# Altium schematic sheet Sheet_2_2021-06-03.schdoc
size 308 x 177 mm
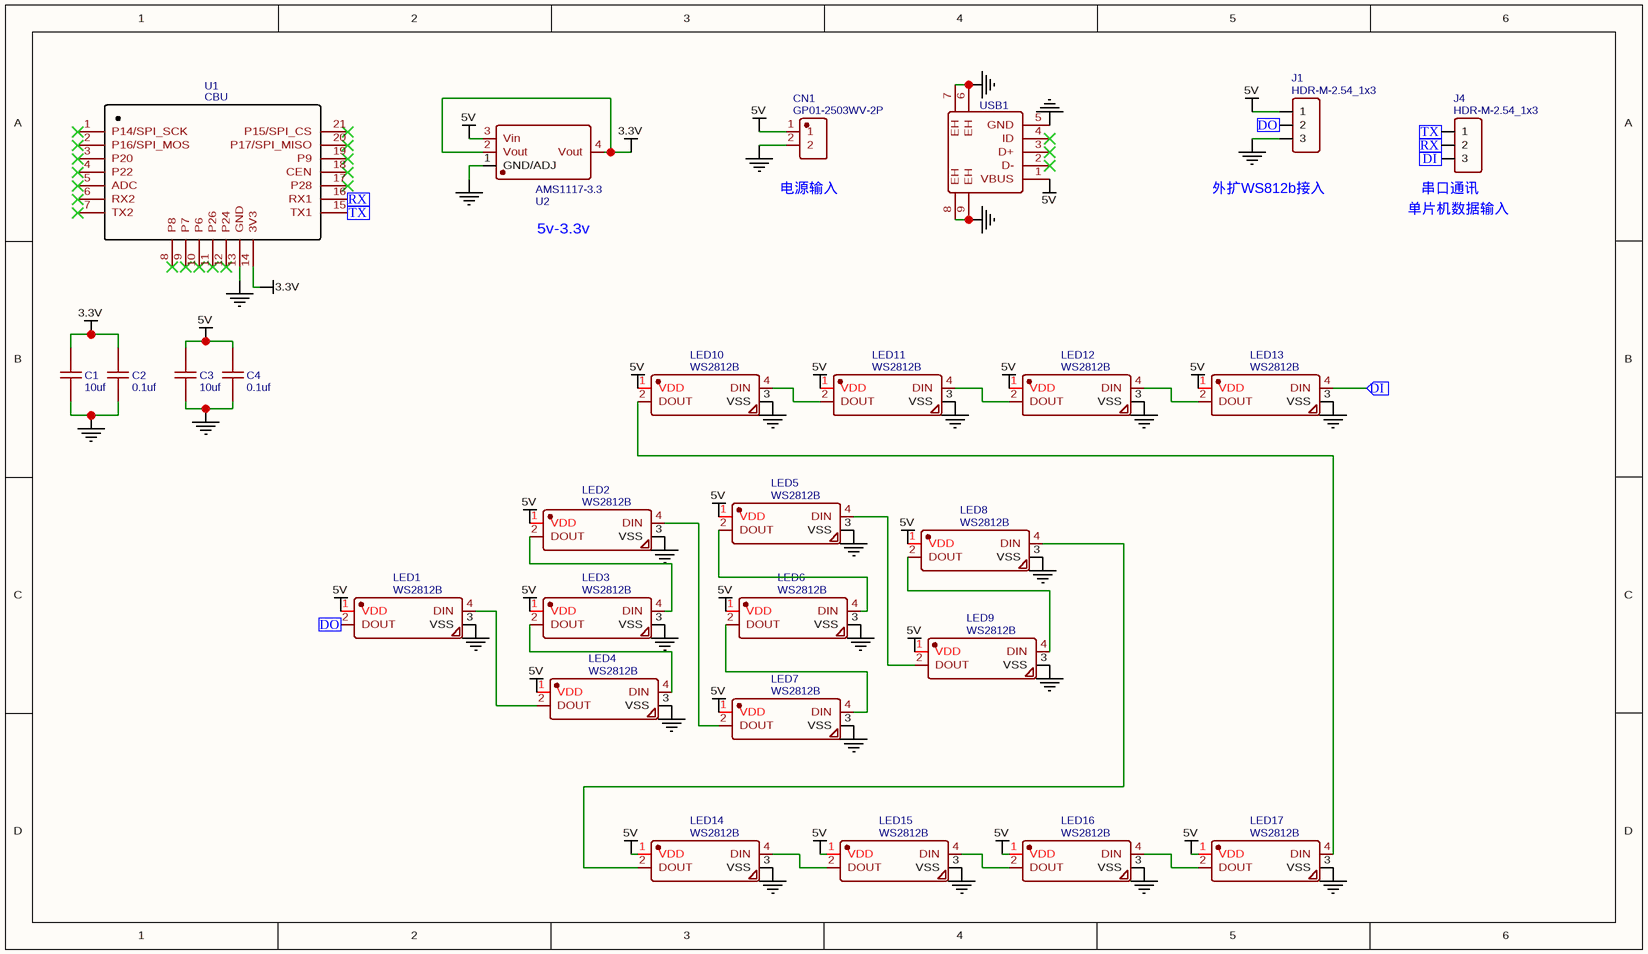
[diagram p0: Sheet_2_2021-06-03.schdoc]

## Parts
C1  10uf  [C0805]
C2  0.1uf  [C0805]
C3  10uf  [C0805]
C4  0.1uf  [C0805]
CN1  GP01-2503WV-2P  [CONN-TH_2P-P2.50_HX25003-2A]
J1  HDR-M-2.54_1x3  [HDR-M-2.54_1X3]
J4  HDR-M-2.54_1x3  [HDR-M-2.54_1X3]
LED1  WS2812B  [LED-SMD_4P-L5.0-W5.0-TL]
LED2  WS2812B  [LED-SMD_4P-L5.0-W5.0-TL]
LED3  WS2812B  [LED-SMD_4P-L5.0-W5.0-TL]
LED4  WS2812B  [LED-SMD_4P-L5.0-W5.0-TL]
LED5  WS2812B  [LED-SMD_4P-L5.0-W5.0-TL]
LED6  WS2812B  [LED-SMD_4P-L5.0-W5.0-TL]
LED7  WS2812B  [LED-SMD_4P-L5.0-W5.0-TL]
LED8  WS2812B  [LED-SMD_4P-L5.0-W5.0-TL]
LED9  WS2812B  [LED-SMD_4P-L5.0-W5.0-TL]
LED10  WS2812B  [LED-SMD_4P-L5.0-W5.0-TL]
LED11  WS2812B  [LED-SMD_4P-L5.0-W5.0-TL]
LED12  WS2812B  [LED-SMD_4P-L5.0-W5.0-TL]
LED13  WS2812B  [LED-SMD_4P-L5.0-W5.0-TL]
LED14  WS2812B  [LED-SMD_4P-L5.0-W5.0-TL]
LED15  WS2812B  [LED-SMD_4P-L5.0-W5.0-TL]
LED16  WS2812B  [LED-SMD_4P-L5.0-W5.0-TL]
LED17  WS2812B  [LED-SMD_4P-L5.0-W5.0-TL]
U1  CBU  [CBU]
U2  AMS1117-3.3  [SOT-223-3_L6.5-W3.4-P2.30-LS7.0-BR]
USB1  KH-MICRO-SMT.ZJ-5P  [MICRO-USB-SMD_KH-MICRO-SMT.ZJ-5P]  (value not drawn)

## Ports
DI (in), DO (in), RX (in), TX (in)

## Nets
3.3V: C1.2 C2.2 U1.14(3V3) U2.2(Vout) U2.4(Vout)
5V: C3.2 C4.2 CN1.1 J1.1 LED1.1(VDD) LED2.1(VDD) LED3.1(VDD) LED4.1(VDD) LED5.1(VDD) LED6.1(VDD) LED7.1(VDD) LED8.1(VDD) LED9.1(VDD) LED10.1(VDD) LED11.1(VDD) LED12.1(VDD) LED13.1(VDD) LED14.1(VDD) LED15.1(VDD) LED16.1(VDD) LED17.1(VDD) U2.3(Vin) USB1.1(VBUS)
GND: C1.1 C2.1 C3.1 C4.1 CN1.2 J1.3 LED1.3(VSS) LED2.3(VSS) LED3.3(VSS) LED4.3(VSS) LED5.3(VSS) LED6.3(VSS) LED7.3(VSS) LED8.3(VSS) LED9.3(VSS) LED10.3(VSS) LED11.3(VSS) LED12.3(VSS) LED13.3(VSS) LED14.3(VSS) LED15.3(VSS) LED16.3(VSS) LED17.3(VSS) U1.13(GND) U2.1(GND/ADJ) USB1.5(GND) USB1.6(EH) USB1.7(EH) USB1.8(EH) USB1.9(EH)
DI: J4.3 LED13.4(DIN) ; port DI
DO: J1.2 LED1.2(DOUT) ; port DO
RX: J4.2 U1.16(RX1) ; port RX
TX: J4.1 U1.15(TX1) ; port TX
NetLED1_4: LED1.4(DIN) LED4.2(DOUT)
NetLED2_2: LED2.2(DOUT) LED3.4(DIN)
NetLED2_4: LED2.4(DIN) LED7.2(DOUT)
NetLED3_2: LED3.2(DOUT) LED4.4(DIN)
NetLED5_2: LED5.2(DOUT) LED6.4(DIN)
NetLED5_4: LED5.4(DIN) LED9.2(DOUT)
NetLED6_2: LED6.2(DOUT) LED7.4(DIN)
NetLED8_2: LED8.2(DOUT) LED9.4(DIN)
NetLED8_4: LED8.4(DIN) LED14.2(DOUT)
NetLED10_2: LED10.2(DOUT) LED17.4(DIN)
NetLED10_4: LED10.4(DIN) LED11.2(DOUT)
NetLED11_4: LED11.4(DIN) LED12.2(DOUT)
NetLED12_4: LED12.4(DIN) LED13.2(DOUT)
NetLED14_4: LED14.4(DIN) LED15.2(DOUT)
NetLED15_4: LED15.4(DIN) LED16.2(DOUT)
NetLED16_4: LED16.4(DIN) LED17.2(DOUT)

Not connected (* = marked no-connect by the designer): U1 1(P14/SPI_SCK)* 2(P16/SPI_MOS)* 3(P20)* 4(P22)* 5(ADC)* 6(RX2)* 7(TX2)* 8(P8)* 9(P7)* 10(P6)* 11(P26)* 12(P24)* 17(P28)* 18(CEN)* 19(P9)* 20(P17/SPI_MISO)* 21(P15/SPI_CS)*; USB1 2(D-)* 3(D+)* 4(ID)*

## Notes on the sheet
- 5v-3.3v
- (near CN1) 电源输入
- (near J1) 外扩WS812b接入
- (near J4) 单片机数据输入
- (near J4) 串口通讯

## Library data of the parts
C1 C3 = 10uf: nameAlias: Value(F); Contributor: LCEDA_Lib; spicePre: C; spiceSymbolName: C_0805_US
C2 C4 = 0.1uf: nameAlias: Value(F); Contributor: LCEDA_Lib; spicePre: C; spiceSymbolName: C_0805_US
CN1 = GP01-2503WV-2P: BOM_Manufacturer: GEPU(歌普); Contributor: LCSC; BOM_Supplier: LCSC; BOM_Supplier Part: C2681728; BOM_Manufacturer Part: GP01-2503WV-2P; JLCPCB Part Class: Extended Part; spicePre: C; spiceSymbolName: GP01-2503WV-2P
J1 J4 = HDR-M-2.54_1x3: Contributor: LCEDA_Lib; BOM_Supplier Part: C180248; BOM_Supplier: LCSC; spicePre: J; spiceSymbolName: HDR-M-2.54_1x3
LED1-LED17 = WS2812B: BOM_Manufacturer: Worldsemi; Contributor: LCSC; BOM_Supplier: LCSC; BOM_Manufacturer Part: WS2812B; BOM_Supplier Part: C114585; BOM_JLCPCB Part Class: Extended Part; spicePre: L; spiceSymbolName: WS2812B
U1 = CBU: Contributor: anhezhou; BOM_Supplier: 涂鸦智能; link: https://developer.tuya.com/cn/docs/iot/device-development/module/wifibt-dual-mode-module/cb-series-module/cbu-module-datasheet?id=Ka07pykl5dk4u#title-5-%E5%B0%BA%E5%AF%B8%E5%B0%81%E8%A3%85; spicePre: U; spiceSymbolName: CBU
U2 = AMS1117-3.3: BOM_Manufacturer: AMS; sourceId: dwIGgezVh; timeStamp: 1476261164; BOM_Supplier: LCSC; BOM_Manufacturer Part: AMS1117-3.3; BOM_Supplier Part: C6186; BOM_JLCPCB Part Class: Basic Part; spicePre: U; spiceSymbolName: AMS1117-3.3
USB1 = KH-MICRO-SMT.ZJ-5P: BOM_Manufacturer: kinghelm(金航标); Contributor: LCSC; BOM_Supplier: LCSC; BOM_Supplier Part: C2688803; BOM_Manufacturer Part: KH-MICRO-SMT.ZJ-5P; BOM_JLCPCB Part Class: Extended Part; spicePre: U; spiceSymbolName: KH-MICRO-SMT.ZJ-5P